# Altium project HeatingAC_GarageProject.PrjPCB
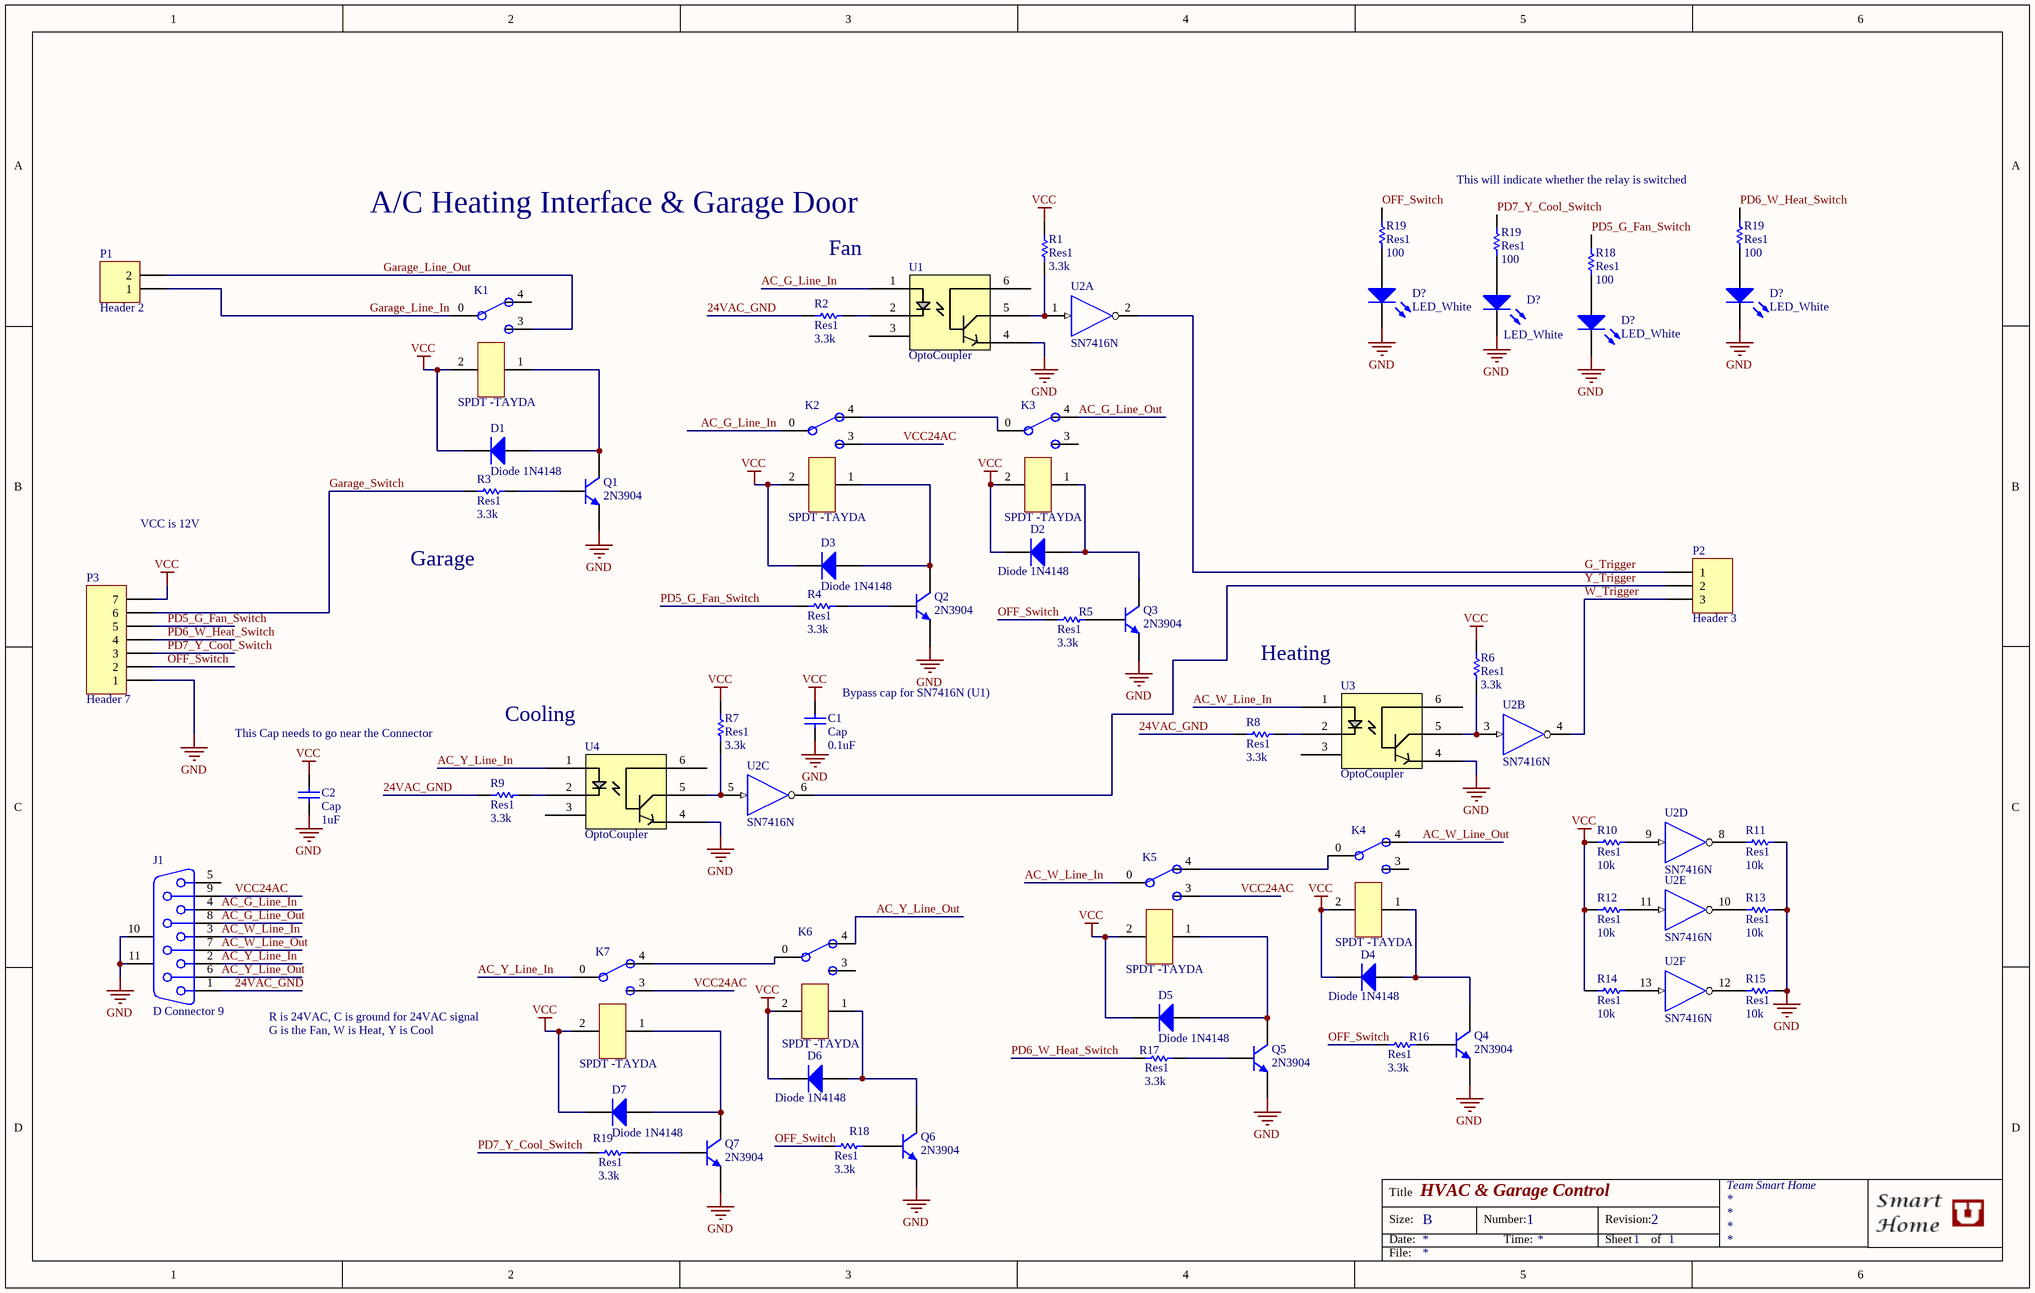
[diagram p0: HeatingAC_Garage.SchDoc]
1 sheet, 58 parts. Net scope: global (net labels, ports and power ports of the same name join across sheets).
Board file: HeatingAC_Garage.PcbDoc

## Sheet HeatingAC_Garage.SchDoc: HVAC & Garage Control
size B; Date: 7/11/2012; CheckedBy: Dell Hanks; Author: Levi Balling; CompanyName: Team Smart House; DrawnBy: Levi Balling; Engineer: Levi Balling; Organization: Team Smart Home; DocumentNumber: 1; Revision: 2; SheetNumber: 1; SheetTotal: 1; VersionControl_RevNumber: 1; DocumentName: HVAC & Garage Control; ModifiedDate: 7/11/2012; ProjectName: Smart Home

### Parts
(Parts that share a designator on the sheet are numbered #1, #2 ... from top to bottom, then left to right.)
C1  Cap  value 0.1uF  [RAD-0.3]
C2  Cap  value 1uF  [RAD-0.3]
D1  Diode 1N4148  [DO-35]
D2  Diode 1N4148  [DO-35]
D3  Diode 1N4148  [DO-35]
D4  Diode 1N4148  [DO-35]
D5  Diode 1N4148  [DO-35]
D6  Diode 1N4148  [DO-35]
D7  Diode 1N4148  [DO-35]
D?#1  LED_White  [LED-0]
D?#2  LED_White  [LED-0]
D?#3  LED_White  [LED-0]
D?#4  LED_White  [LED-0]
J1  D Connector 9  [DSUB1.385-2H9]
K1  SPDT -TAYDA  [Relay  SPDT Tayda]
K2  SPDT -TAYDA  [Relay  SPDT Tayda]
K3  SPDT -TAYDA  [Relay  SPDT Tayda]
K4  SPDT -TAYDA  [Relay  SPDT Tayda]
K5  SPDT -TAYDA  [Relay  SPDT Tayda]
K6  SPDT -TAYDA  [Relay  SPDT Tayda]
K7  SPDT -TAYDA  [Relay  SPDT Tayda]
P1  Header 2  [HDR1X2]
P2  Header 3  [HDR1X3]
P3  Header 7  [HDR1X7]
Q1  2N3904  [2N3904]
Q2  2N3904  [2N3904]
Q3  2N3904  [2N3904]
Q4  2N3904  [2N3904]
Q5  2N3904  [2N3904]
Q6  2N3904  [2N3904]
Q7  2N3904  [2N3904]
R1  Res1  value 3.3k  [AXIAL-0.3]
R2  Res1  value 3.3k  [AXIAL-0.3]
R3  Res1  value 3.3k  [AXIAL-0.3]
R4  Res1  value 3.3k  [AXIAL-0.3]
R5  Res1  value 3.3k  [AXIAL-0.3]
R6  Res1  value 3.3k  [AXIAL-0.3]
R7  Res1  value 3.3k  [AXIAL-0.3]
R8  Res1  value 3.3k  [AXIAL-0.3]
R9  Res1  value 3.3k  [AXIAL-0.3]
R10  Res1  value 10k  [AXIAL-0.3]
R11  Res1  value 10k  [AXIAL-0.3]
R12  Res1  value 10k  [AXIAL-0.3]
R13  Res1  value 10k  [AXIAL-0.3]
R14  Res1  value 10k  [AXIAL-0.3]
R15  Res1  value 10k  [AXIAL-0.3]
R16  Res1  value 3.3k  [AXIAL-0.3]
R17  Res1  value 3.3k  [AXIAL-0.3]
R18#1  Res1  value 100  [AXIAL-0.3]
R18#2  Res1  value 3.3k  [AXIAL-0.3]
R19#1  Res1  value 100  [AXIAL-0.3]
R19#2  Res1  value 100  [AXIAL-0.3]
R19#3  Res1  value 100  [AXIAL-0.3]
R19#4  Res1  value 3.3k  [AXIAL-0.3]
U1  OptoCoupler  [Octocoupler]
U2  SN7416N  [N014]  (parts A,B,C,D,E,F of 6)
U3  OptoCoupler  [Octocoupler]
U4  OptoCoupler  [Octocoupler]

### Nets
GND: C1.1 C2.1 D?#1.2(K) D?#2.2(K) D?#3.2(K) D?#4.2(K) J1.10(MH1) J1.11(MH2) P3.1 Q1.1(E) Q2.1(E) Q3.1(E) Q4.1(E) Q5.1(E) Q6.1(E) Q7.1(E) R11.2 R13.2 R15.2 U1.4(Emitter) U2.7(GND) U3.4(Emitter) U4.4(Emitter)
VCC: C1.2 C2.2 D1.2(K) D2.2(K) D3.2(K) D4.2(K) D5.2(K) D6.2(K) D7.2(K) K1.2 K2.2 K3.2 K4.2 K5.2 K6.2 K7.2 P3.7 R1.2 R6.2 R7.2 R10.1 R12.1 R14.1 U2.14(VCC)
24VAC_GND: J1.1 R2.1 R8.1 R9.1
AC_G_Line_In: J1.4 K2.0 U1.1(Anode)
AC_G_Line_Out: J1.8 K3.4
AC_W_Line_In: J1.3 K5.0 U3.1(Anode)
AC_W_Line_Out: J1.7 K4.4
AC_Y_Line_In: J1.2 K7.0 U4.1(Anode)
AC_Y_Line_Out: J1.6 K6.4
G_Trigger: P2.1 U2.2(Y)
Garage_Line_In: K1.0 P1.1
Garage_Line_Out: K1.3 P1.2
Garage_Switch: P3.6 R3.1
OFF_Switch: P3.2 R5.1 R16.1 R18#2.1 R19#1.1
PD5_G_Fan_Switch: P3.5 R4.1 R18#1.1
PD6_W_Heat_Switch: P3.4 R17.1 R19#2.1
PD7_Y_Cool_Switch: P3.3 R19#3.1 R19#4.1
VCC24AC: J1.9 K2.3 K5.3 K7.3
W_Trigger: P2.3 U2.4(Y)
Y_Trigger: P2.2 U2.6(Y)
NetD1_1: D1.1(A) K1.1 Q1.3(C)
NetD2_1: D2.1(A) K3.1 Q3.3(C)
NetD3_1: D3.1(A) K2.1 Q2.3(C)
NetD4_1: D4.1(A) K4.1 Q4.3(C)
NetD5_1: D5.1(A) K5.1 Q5.3(C)
NetD6_1: D6.1(A) K6.1 Q6.3(C)
NetD7_1: D7.1(A) K7.1 Q7.3(C)
NetD?#1_1: D?#1.1(A) R19#1.2
NetD?#2_1: D?#2.1(A) R19#2.2
NetD?#3_1: D?#3.1(A) R19#3.2
NetD?#4_1: D?#4.1(A) R18#1.2
NetK2_4: K2.4 K3.0
NetK4_0: K4.0 K5.4
NetK6_0: K6.0 K7.4
NetQ1_2: Q1.2(B) R3.2
NetQ2_2: Q2.2(B) R4.2
NetQ3_2: Q3.2(B) R5.2
NetQ4_2: Q4.2(B) R16.2
NetQ5_2: Q5.2(B) R17.2
NetQ6_2: Q6.2(B) R18#2.2
NetQ7_2: Q7.2(B) R19#4.2
NetR1_1: R1.1 U1.5(Collector) U2.1(A)
NetR2_2: R2.2 U1.2(Cathode)
NetR6_1: R6.1 U2.3(A) U3.5(Collector)
NetR7_1: R7.1 U2.5(A) U4.5(Collector)
NetR8_2: R8.2 U3.2(Cathode)
NetR9_2: R9.2 U4.2(Cathode)
NetR10_2: R10.2 U2.9(A)
NetR11_1: R11.1 U2.8(Y)
NetR12_2: R12.2 U2.11(A)
NetR13_1: R13.1 U2.10(Y)
NetR14_2: R14.2 U2.13(A)
NetR15_1: R15.1 U2.12(Y)

Not connected (* = marked no-connect by the designer): J1 5; K1 4; K3 3; K4 3; K6 3; U1 3 6(Base); U3 3 6(Base); U4 3 6(Base)

### Notes on the sheet
- A/C Heating Interface & Garage Door
- (near R19#2) This will indicate whether the relay is switched
- Fan
- VCC is 12V
- Garage
- (near C1) Bypass cap for SN7416N (U1)
- (near U3) Heating
- This Cap needs to go near the Connector
- (near U4) Cooling
- R is 24VAC, C is ground for 24VAC signal
- G is the Fan, W is Heat, Y is Cool
- Title
- Size:
- Date:
- B
- Number:
- Time:
- Revision:
- Sheet
- of
- File:

### Library data of the parts
C1 C2 = Cap: Capacitor; Published: 8-Jun-2000; LatestRevisionDate: 17-Jul-2002; LatestRevisionNote: Re-released for DXP Platform.; PackageReference: RAD-0.3; Publisher: Altium Limited; PackageDescription: Radial Cap, Thru-Hole; 2 Leads; 0.3 in Pin Spacing
D1-D7 = Diode 1N4148: High Conductance Fast Diode; Published: 8-Jun-2000; LatestRevisionDate: 17-Jul-2002; LatestRevisionNote: Re-released for DXP Platform.; DatasheetVersion: 1997; PackageReference: DO-35; Publisher: Altium Limited; PackageDescription: Diode, Axial; Body 3.8 x 1.9 mm (LxDia. max), Lead Dia. 0.53 mm (max); Code_JEDEC: DO-204-AH; ComponentLink1Description: Manufacturer Link; ComponentLink1URL: http://www.fairchildsemi.com/; ComponentLink2Description: Datasheet; ComponentLink2URL: http://www.fairchildsemi.com/ds/1N%2F1N4148.pdf
D?#1-D?#4 = LED0: Typical INFRARED GaAs LED; Published: 8-Jun-2000; LatestRevisionDate: 08-Jul-2005; LatestRevisionNote: Mech Layer 1 removed.; PackageReference: LED-0; Publisher: Altium Limited; PackageDescription: LED; 2 Leads
J1 = D Connector 9: Receptacle Assembly, 9 Position, Right Angle; PackageDocument: O; Positions: 9; Published: 15-Jun-2001; LatestRevisionDate: 17-Jul-2002; LatestRevisionNote: Re-released for DXP Platform.; DatasheetDocument: 1-Sep-1999; PackageReference: 788750; Publisher: Altium Limited; Orientation: Right Angle; Gender: Receptacle
K1-K7 = SPDT
P1 = Header 2: Header, 2-Pin; LatestRevisionDate: 17-Jul-2002; LatestRevisionNote: Re-released for DXP Platform.; Publisher: Altium Limited
P2 = Header 3: Header, 3-Pin; LatestRevisionDate: 17-Jul-2002; LatestRevisionNote: Re-released for DXP Platform.; Publisher: Altium Limited
P3 = Header 7: Header, 7-Pin; LatestRevisionDate: 17-Jul-2002; LatestRevisionNote: Re-released for DXP Platform.; Publisher: Altium Limited
Q1-Q7 = 2N3904: NPN General Purpose Amplifier; Published: 8-Jun-2000; LatestRevisionDate: 15-Jan-2003; LatestRevisionNote: PCB Footprint 'BCY-W3/D4.7' replaced; DatasheetVersion: 1997; PackageVersion: Sep-1998; PackageReference: TO-92A; Publisher: Altium Limited; PackageDescription: TO, Flat Index; 3 In-Line, Axial Leads; Body Dia. 4.5mm; Leads 0.51 x 0.48 mm (max); ComponentLink1Description: Manufacturer Link; ComponentLink1URL: http://www.fairchildsemi.com/; ComponentLink2Description: Datasheet; ComponentLink2URL: http://www.fairchildsemi.com/ds/2N%2F2N3904.pdf
R1-R17 R18#1 R18#2 R19#1-R19#4 = Res1: Resistor; Published: 8-Jun-2000; LatestRevisionDate: 17-Jul-2002; LatestRevisionNote: Re-released for DXP Platform.; PackageReference: AXIAL-0.3; Publisher: Altium Limited; PackageDescription: Axial Device, Thru-Hole; 2 Leads; 0.3 in Pin Spacing
U2 = SN7416N: Hex Inverter Buffer / Driver with High-Voltage Outputs; Published: 8-Jun-2000; LatestRevisionDate: 04-Mar-2005; LatestRevisionNote: Stylized 3D Model Added.; DatasheetVersion: Mar-1988; PackageVersion: Oct-1995; PackageReference: N014; Publisher: Altium Limited; PackageDescription: DIP; 14 Leads; Row Spacing 7.62 mm; Pitch 2.54 mm; ComponentLink1Description: Manufacturer Link; ComponentLink1URL: http://www.ti.com/; ComponentLink2Description: Datasheet; ComponentLink2URL: http://www-s.ti.com/sc/ds/sn5416.pdf; ComponentLink3Description: Packaging Specification; ComponentLink3URL: http://focus.ti.com/lit/ml/mpdi002c/mpdi002c.pdf